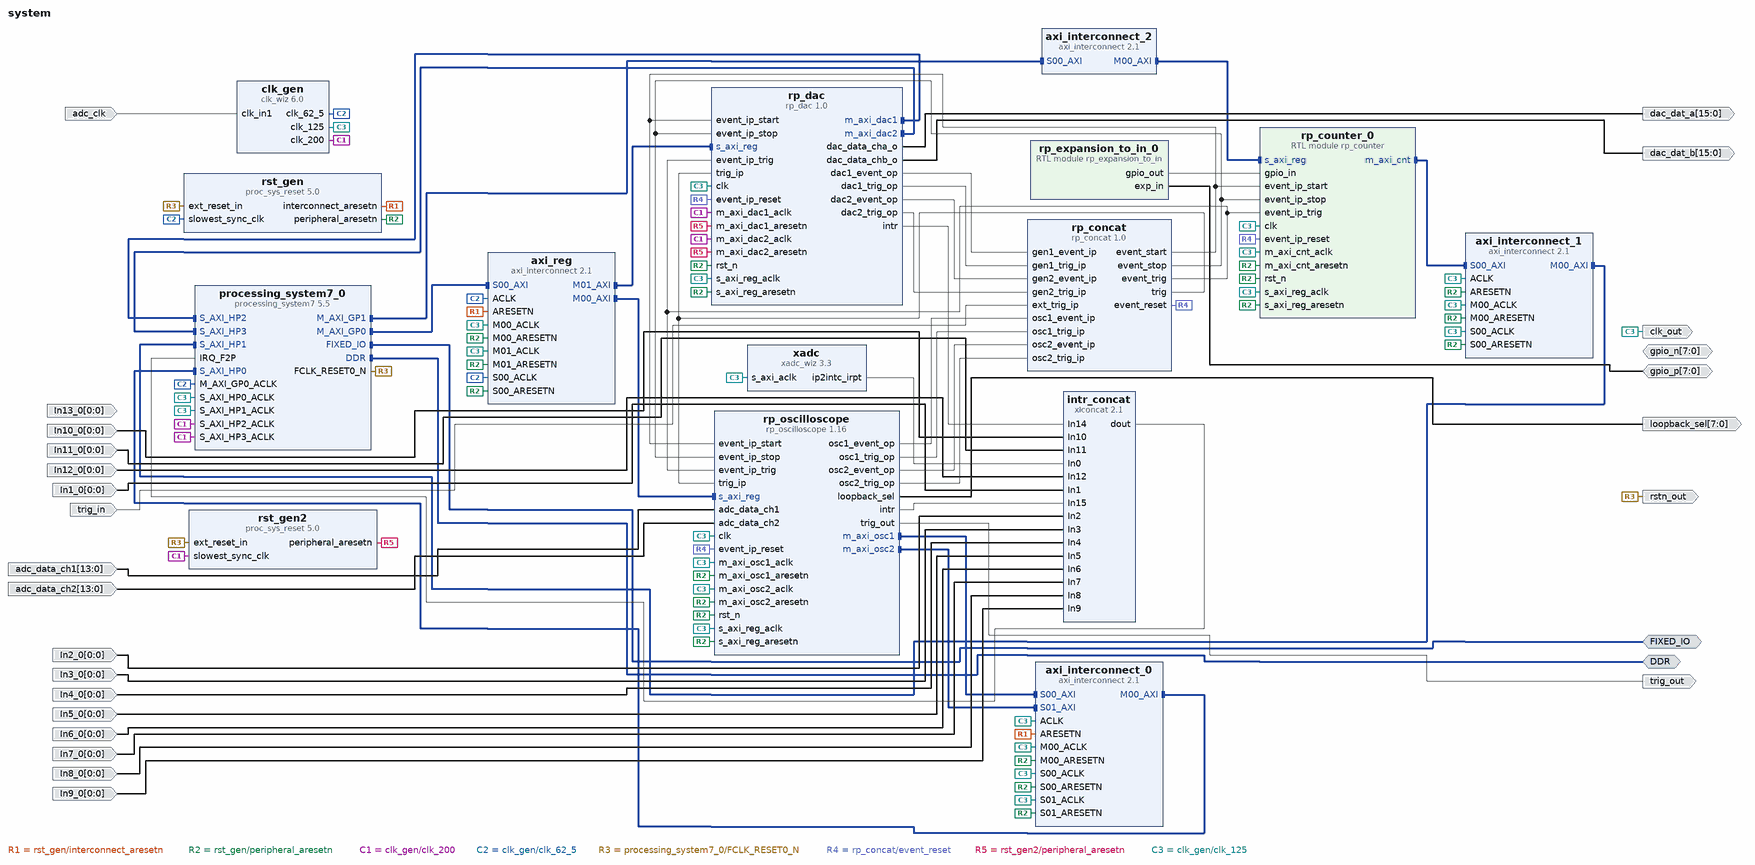
[diagram p0: block diagram of the top level]
# Vivado block design system, xc7z010clg400-1, Vivado 2020.1
create_bd_design system

create_bd_intf_port -mode Master -vlnv xilinx.com:interface:ddrx_rtl:1.0 DDR
create_bd_intf_port -mode Master -vlnv xilinx.com:display_processing_system7:fixedio_rtl:1.0 FIXED_IO
create_bd_port -dir I -from 0 -to 0 In10_0
create_bd_port -dir I -from 0 -to 0 In11_0
create_bd_port -dir I -from 0 -to 0 In12_0
create_bd_port -dir I -from 0 -to 0 In13_0
create_bd_port -dir I -from 0 -to 0 In1_0
create_bd_port -dir I -from 0 -to 0 In2_0
create_bd_port -dir I -from 0 -to 0 In3_0
create_bd_port -dir I -from 0 -to 0 In4_0
create_bd_port -dir I -from 0 -to 0 In5_0
create_bd_port -dir I -from 0 -to 0 In6_0
create_bd_port -dir I -from 0 -to 0 In7_0
create_bd_port -dir I -from 0 -to 0 In8_0
create_bd_port -dir I -from 0 -to 0 In9_0
create_bd_port -dir I -type clk adc_clk
set_property -dict {CONFIG.FREQ_HZ 125000000} [get_bd_ports adc_clk]
create_bd_port -dir I -from 13 -to 0 adc_data_ch1
create_bd_port -dir I -from 13 -to 0 adc_data_ch2
create_bd_port -dir O -type clk clk_out
set_property -dict {CONFIG.FREQ_HZ 125000000} [get_bd_ports clk_out]
create_bd_port -dir O -from 15 -to 0 dac_dat_a
create_bd_port -dir O -from 15 -to 0 dac_dat_b
create_bd_port -dir IO -from 7 -to 0 gpio_n
create_bd_port -dir IO -from 7 -to 0 gpio_p
create_bd_port -dir O -from 7 -to 0 loopback_sel
create_bd_port -dir O -type rst rstn_out
create_bd_port -dir I trig_in
create_bd_port -dir O trig_out

create_bd_cell -type ip -vlnv xilinx.com:ip:axi_interconnect:2.1 axi_interconnect_0
set_property -dict {CONFIG.NUM_MI 1 CONFIG.NUM_SI 2} [get_bd_cells axi_interconnect_0]
create_bd_cell -type ip -vlnv xilinx.com:ip:axi_interconnect:2.1 axi_reg
set_property -dict {CONFIG.ENABLE_ADVANCED_OPTIONS 1 CONFIG.NUM_MI 2 CONFIG.S00_HAS_REGSLICE 0} [get_bd_cells axi_reg]
create_bd_cell -type ip -vlnv xilinx.com:ip:clk_wiz:6.0 clk_gen
set_property -dict [list \
  CONFIG.CLKIN1_JITTER_PS 80.0 \
  CONFIG.CLKOUT1_JITTER 119.348 \
  CONFIG.CLKOUT1_PHASE_ERROR 96.948 \
  CONFIG.CLKOUT1_REQUESTED_OUT_FREQ 125 \
  CONFIG.CLKOUT2_JITTER 104.759 \
  CONFIG.CLKOUT2_PHASE_ERROR 96.948 \
  CONFIG.CLKOUT2_REQUESTED_OUT_FREQ 250 \
  CONFIG.CLKOUT2_USED true \
  CONFIG.CLKOUT3_JITTER 99.263 \
  CONFIG.CLKOUT3_PHASE_ERROR 96.948 \
  CONFIG.CLKOUT3_REQUESTED_OUT_FREQ 333.33333 \
  CONFIG.CLKOUT3_USED true \
  CONFIG.CLKOUT4_JITTER 137.150 \
  CONFIG.CLKOUT4_PHASE_ERROR 96.948 \
  CONFIG.CLKOUT4_REQUESTED_OUT_FREQ 62.5 \
  CONFIG.CLKOUT4_USED true \
  CONFIG.CLK_OUT1_PORT clk_125 \
  CONFIG.CLK_OUT2_PORT clk_200 \
  CONFIG.CLK_OUT3_PORT clk_333 \
  CONFIG.CLK_OUT4_PORT clk_62_5 \
  CONFIG.ENABLE_CLOCK_MONITOR false \
  CONFIG.MMCM_CLKFBOUT_MULT_F 8.000 \
  CONFIG.MMCM_CLKIN1_PERIOD 8.000 \
  CONFIG.MMCM_CLKOUT0_DIVIDE_F 8.000 \
  CONFIG.MMCM_CLKOUT1_DIVIDE 4 \
  CONFIG.MMCM_CLKOUT2_DIVIDE 3 \
  CONFIG.MMCM_CLKOUT3_DIVIDE 16 \
  CONFIG.NUM_OUT_CLKS 4 \
  CONFIG.PRIMITIVE MMCM \
  CONFIG.PRIM_IN_FREQ 125 \
  CONFIG.USE_LOCKED false \
  CONFIG.USE_RESET false \
] [get_bd_cells clk_gen]
create_bd_cell -type ip -vlnv xilinx.com:ip:xlconcat:2.1 intr_concat
set_property -dict {CONFIG.NUM_PORTS 16} [get_bd_cells intr_concat]
create_bd_cell -type ip -vlnv xilinx.com:ip:processing_system7:5.5 processing_system7_0
set_property -dict [list \
  CONFIG.PCW_APU_PERIPHERAL_FREQMHZ 666.666666 \
  CONFIG.PCW_ENET0_ENET0_IO {MIO 16 .. 27} \
  CONFIG.PCW_ENET0_GRP_MDIO_ENABLE 1 \
  CONFIG.PCW_ENET0_GRP_MDIO_IO {MIO 52 .. 53} \
  CONFIG.PCW_ENET0_PERIPHERAL_ENABLE 1 \
  CONFIG.PCW_ENET0_RESET_ENABLE 0 \
  CONFIG.PCW_ENET_RESET_ENABLE 1 \
  CONFIG.PCW_ENET_RESET_SELECT {Share reset pin} \
  CONFIG.PCW_EN_CLK1_PORT 1 \
  CONFIG.PCW_FCLK_CLK1_BUF TRUE \
  CONFIG.PCW_FPGA0_PERIPHERAL_FREQMHZ 50 \
  CONFIG.PCW_FPGA1_PERIPHERAL_FREQMHZ 25 \
  CONFIG.PCW_FPGA_FCLK1_ENABLE 1 \
  CONFIG.PCW_GPIO_EMIO_GPIO_ENABLE 1 \
  CONFIG.PCW_GPIO_EMIO_GPIO_IO 24 \
  CONFIG.PCW_GPIO_EMIO_GPIO_WIDTH 24 \
  CONFIG.PCW_GPIO_MIO_GPIO_ENABLE 1 \
  CONFIG.PCW_GPIO_MIO_GPIO_IO MIO \
  CONFIG.PCW_I2C0_GRP_INT_ENABLE 0 \
  CONFIG.PCW_I2C0_I2C0_IO {MIO 50 .. 51} \
  CONFIG.PCW_I2C0_PERIPHERAL_ENABLE 1 \
  CONFIG.PCW_I2C_PERIPHERAL_FREQMHZ 111.111115 \
  CONFIG.PCW_I2C_RESET_ENABLE 1 \
  CONFIG.PCW_I2C_RESET_SELECT {Share reset pin} \
  CONFIG.PCW_IRQ_F2P_INTR 1 \
  CONFIG.PCW_PERIPHERAL_BOARD_PRESET part0 \
  CONFIG.PCW_PRESET_BANK1_VOLTAGE {LVCMOS 2.5V} \
  CONFIG.PCW_QSPI_GRP_SINGLE_SS_ENABLE 1 \
  CONFIG.PCW_QSPI_GRP_SINGLE_SS_IO {MIO 1 .. 6} \
  CONFIG.PCW_QSPI_PERIPHERAL_ENABLE 1 \
  CONFIG.PCW_QSPI_QSPI_IO {MIO 1 .. 6} \
  CONFIG.PCW_SD0_GRP_CD_ENABLE 1 \
  CONFIG.PCW_SD0_GRP_CD_IO {MIO 46} \
  CONFIG.PCW_SD0_GRP_WP_ENABLE 1 \
  CONFIG.PCW_SD0_GRP_WP_IO {MIO 47} \
  CONFIG.PCW_SD0_PERIPHERAL_ENABLE 1 \
  CONFIG.PCW_SD0_SD0_IO {MIO 40 .. 45} \
  CONFIG.PCW_SDIO_PERIPHERAL_FREQMHZ 100 \
  CONFIG.PCW_SINGLE_QSPI_DATA_MODE x4 \
  CONFIG.PCW_SPI1_PERIPHERAL_ENABLE 1 \
  CONFIG.PCW_SPI1_SPI1_IO {MIO 10 .. 15} \
  CONFIG.PCW_S_AXI_HP2_ID_WIDTH 4 \
  CONFIG.PCW_S_AXI_HP3_ID_WIDTH 4 \
  CONFIG.PCW_TTC0_PERIPHERAL_ENABLE 1 \
  CONFIG.PCW_TTC0_TTC0_IO EMIO \
  CONFIG.PCW_UART0_PERIPHERAL_ENABLE 1 \
  CONFIG.PCW_UART0_UART0_IO {MIO 14 .. 15} \
  CONFIG.PCW_UART1_PERIPHERAL_ENABLE 1 \
  CONFIG.PCW_UART1_UART1_IO {MIO 8 .. 9} \
  CONFIG.PCW_UART_PERIPHERAL_FREQMHZ 100 \
  CONFIG.PCW_UIPARAM_DDR_BUS_WIDTH {16 Bit} \
  CONFIG.PCW_UIPARAM_DDR_FREQ_MHZ 533.333333 \
  CONFIG.PCW_UIPARAM_DDR_PARTNO {MT41J256M16 RE-125} \
  CONFIG.PCW_USB0_PERIPHERAL_ENABLE 1 \
  CONFIG.PCW_USB0_RESET_ENABLE 1 \
  CONFIG.PCW_USB0_RESET_IO {MIO 48} \
  CONFIG.PCW_USB0_USB0_IO {MIO 28 .. 39} \
  CONFIG.PCW_USB_RESET_ENABLE 1 \
  CONFIG.PCW_USB_RESET_SELECT {Share reset pin} \
  CONFIG.PCW_USE_FABRIC_INTERRUPT 1 \
  CONFIG.PCW_USE_M_AXI_GP1 1 \
  CONFIG.PCW_USE_S_AXI_HP0 1 \
  CONFIG.PCW_USE_S_AXI_HP1 1 \
  CONFIG.PCW_USE_S_AXI_HP2 1 \
  CONFIG.PCW_USE_S_AXI_HP3 1 \
] [get_bd_cells processing_system7_0]
# 543 more settings of processing_system7_0 are not shown: defaults, MIO pin electricals, DDR timing, and values the tool derives
create_bd_cell -type ip -vlnv redpitaya.com:user:rp_concat:1.0 rp_concat
set_property -dict {CONFIG.EVENT_SRC_NUM 5 CONFIG.TRIG_SRC_NUM 6} [get_bd_cells rp_concat]
create_bd_cell -type ip -vlnv redpitaya.com:user:rp_dac:1.0 rp_dac
set_property -dict [list \
  CONFIG.DAC_DATA_BITS 16 \
  CONFIG.EVENT_SRC_NUM 5 \
  CONFIG.ID_WIDTH 4 \
  CONFIG.M_AXI_DAC_ADDR_BITS 32 \
  CONFIG.M_AXI_DAC_DATA_BITS 64 \
  CONFIG.M_AXI_DAC_DATA_BITS_O 64 \
  CONFIG.TRIG_SRC_NUM 6 \
] [get_bd_cells rp_dac]
create_bd_cell -type ip -vlnv redpitaya.com:user:rp_oscilloscope:1.16 rp_oscilloscope
set_property -dict {CONFIG.ADC_DATA_BITS 14 CONFIG.EVENT_SRC_NUM 5 CONFIG.TRIG_SRC_NUM 6} [get_bd_cells rp_oscilloscope]
create_bd_cell -type ip -vlnv xilinx.com:ip:proc_sys_reset:5.0 rst_gen
create_bd_cell -type ip -vlnv xilinx.com:ip:proc_sys_reset:5.0 rst_gen2
create_bd_cell -type ip -vlnv xilinx.com:ip:xadc_wiz:3.3 xadc
set_property -dict [list \
  CONFIG.CHANNEL_ENABLE_VAUXP0_VAUXN0 true \
  CONFIG.CHANNEL_ENABLE_VAUXP1_VAUXN1 true \
  CONFIG.CHANNEL_ENABLE_VAUXP8_VAUXN8 true \
  CONFIG.CHANNEL_ENABLE_VAUXP9_VAUXN9 true \
  CONFIG.CHANNEL_ENABLE_VP_VN true \
  CONFIG.ENABLE_RESET false \
  CONFIG.EXTERNAL_MUX_CHANNEL VP_VN \
  CONFIG.INTERFACE_SELECTION Enable_AXI \
  CONFIG.SEQUENCER_MODE Off \
  CONFIG.SINGLE_CHANNEL_SELECTION TEMPERATURE \
  CONFIG.XADC_STARUP_SELECTION independent_adc \
] [get_bd_cells xadc]
create_bd_cell -type ip -vlnv xilinx.com:ip:axi_interconnect:2.1 axi_interconnect_1
set_property -dict {CONFIG.NUM_MI 1} [get_bd_cells axi_interconnect_1]
create_bd_cell -type module -reference rp_expansion_to_in rp_expansion_to_in_0
set_property -dict {CONFIG.N_CON 0} [get_bd_cells rp_expansion_to_in_0]
create_bd_cell -type module -reference rp_counter rp_counter_0
create_bd_cell -type ip -vlnv xilinx.com:ip:axi_interconnect:2.1 axi_interconnect_2
set_property -dict {CONFIG.NUM_MI 1} [get_bd_cells axi_interconnect_2]

# ---- connections ----

connect_bd_intf_net [get_bd_intf_ports FIXED_IO] [get_bd_intf_pins processing_system7_0/FIXED_IO]
connect_bd_intf_net [get_bd_intf_pins axi_reg/S00_AXI] [get_bd_intf_pins processing_system7_0/M_AXI_GP0]
connect_bd_intf_net [get_bd_intf_pins processing_system7_0/S_AXI_HP2] [get_bd_intf_pins rp_dac/m_axi_dac1]
connect_bd_intf_net [get_bd_intf_pins processing_system7_0/S_AXI_HP3] [get_bd_intf_pins rp_dac/m_axi_dac2]
connect_bd_intf_net [get_bd_intf_pins axi_interconnect_0/S00_AXI] [get_bd_intf_pins rp_oscilloscope/m_axi_osc1]
connect_bd_intf_net [get_bd_intf_pins axi_interconnect_0/S01_AXI] [get_bd_intf_pins rp_oscilloscope/m_axi_osc2]
connect_bd_intf_net [get_bd_intf_ports DDR] [get_bd_intf_pins processing_system7_0/DDR]
connect_bd_intf_net [get_bd_intf_pins axi_reg/M01_AXI] [get_bd_intf_pins rp_dac/s_axi_reg]
connect_bd_intf_net [get_bd_intf_pins axi_reg/M00_AXI] [get_bd_intf_pins rp_oscilloscope/s_axi_reg]
connect_bd_intf_net [get_bd_intf_pins axi_interconnect_0/M00_AXI] [get_bd_intf_pins processing_system7_0/S_AXI_HP0]
connect_bd_intf_net [get_bd_intf_pins axi_interconnect_1/M00_AXI] [get_bd_intf_pins processing_system7_0/S_AXI_HP1]
connect_bd_intf_net [get_bd_intf_pins rp_counter_0/m_axi_cnt] [get_bd_intf_pins axi_interconnect_1/S00_AXI]
connect_bd_intf_net [get_bd_intf_pins rp_counter_0/s_axi_reg] [get_bd_intf_pins axi_interconnect_2/M00_AXI]
connect_bd_intf_net [get_bd_intf_pins axi_interconnect_2/S00_AXI] [get_bd_intf_pins processing_system7_0/M_AXI_GP1]
connect_bd_net -net ARESETN_1 [get_bd_pins rst_gen/interconnect_aresetn] [get_bd_pins axi_interconnect_0/ARESETN] [get_bd_pins axi_reg/ARESETN]
connect_bd_net -net In10_0_1 [get_bd_ports In10_0] [get_bd_pins intr_concat/In10]
connect_bd_net -net In11_0_1 [get_bd_ports In11_0] [get_bd_pins intr_concat/In11]
connect_bd_net -net In12_0_1 [get_bd_ports In12_0] [get_bd_pins intr_concat/In12]
connect_bd_net -net In1_0_1 [get_bd_ports In1_0] [get_bd_pins intr_concat/In1]
connect_bd_net -net In2_0_1 [get_bd_ports In2_0] [get_bd_pins intr_concat/In2]
connect_bd_net -net In3_0_1 [get_bd_ports In3_0] [get_bd_pins intr_concat/In3]
connect_bd_net -net In4_0_1 [get_bd_ports In4_0] [get_bd_pins intr_concat/In4]
connect_bd_net -net In5_0_1 [get_bd_ports In5_0] [get_bd_pins intr_concat/In5]
connect_bd_net -net In6_0_1 [get_bd_ports In6_0] [get_bd_pins intr_concat/In6]
connect_bd_net -net In7_0_1 [get_bd_ports In7_0] [get_bd_pins intr_concat/In7]
connect_bd_net -net In8_0_1 [get_bd_ports In8_0] [get_bd_pins intr_concat/In8]
connect_bd_net -net In9_0_1 [get_bd_ports In9_0] [get_bd_pins intr_concat/In9]
connect_bd_net -net M00_ARESETN_1 [get_bd_pins rst_gen/peripheral_aresetn] \
  [get_bd_pins axi_interconnect_0/M00_ARESETN] [get_bd_pins axi_interconnect_0/S00_ARESETN] \
  [get_bd_pins axi_interconnect_0/S01_ARESETN] [get_bd_pins axi_reg/M00_ARESETN] [get_bd_pins axi_reg/M01_ARESETN] \
  [get_bd_pins axi_reg/S00_ARESETN] [get_bd_pins rp_dac/rst_n] [get_bd_pins rp_dac/s_axi_reg_aresetn] \
  [get_bd_pins rp_oscilloscope/m_axi_osc1_aresetn] [get_bd_pins rp_oscilloscope/m_axi_osc2_aresetn] \
  [get_bd_pins rp_oscilloscope/rst_n] [get_bd_pins rp_oscilloscope/s_axi_reg_aresetn] \
  [get_bd_pins axi_interconnect_1/M00_ARESETN] [get_bd_pins axi_interconnect_1/S00_ARESETN] \
  [get_bd_pins axi_interconnect_1/ARESETN] [get_bd_pins rp_counter_0/rst_n] [get_bd_pins rp_counter_0/s_axi_reg_aresetn] \
  [get_bd_pins rp_counter_0/m_axi_cnt_aresetn]
connect_bd_net [get_bd_ports adc_clk] [get_bd_pins clk_gen/clk_in1]
connect_bd_net -net adc_data_ch1_0_1 [get_bd_ports adc_data_ch1] [get_bd_pins rp_oscilloscope/adc_data_ch1]
connect_bd_net -net adc_data_ch2_0_1 [get_bd_ports adc_data_ch2] [get_bd_pins rp_oscilloscope/adc_data_ch2]
connect_bd_net [get_bd_pins clk_gen/clk_200] \
  [get_bd_pins processing_system7_0/S_AXI_HP2_ACLK] [get_bd_pins processing_system7_0/S_AXI_HP3_ACLK] \
  [get_bd_pins rp_dac/m_axi_dac1_aclk] [get_bd_pins rp_dac/m_axi_dac2_aclk] [get_bd_pins rst_gen2/slowest_sync_clk]
connect_bd_net [get_bd_pins clk_gen/clk_62_5] \
  [get_bd_pins axi_reg/ACLK] [get_bd_pins axi_reg/S00_ACLK] [get_bd_pins processing_system7_0/M_AXI_GP0_ACLK] \
  [get_bd_pins rst_gen/slowest_sync_clk]
connect_bd_net -net dac_data_ch1_0_1 [get_bd_pins rp_dac/dac_data_cha_o] [get_bd_ports dac_dat_a]
connect_bd_net -net dac_data_ch2_0_1 [get_bd_pins rp_dac/dac_data_chb_o] [get_bd_ports dac_dat_b]
connect_bd_net -net loopback_sel_scope [get_bd_pins rp_oscilloscope/loopback_sel] [get_bd_ports loopback_sel]
connect_bd_net [get_bd_pins processing_system7_0/FCLK_RESET0_N] \
  [get_bd_ports rstn_out] [get_bd_pins rst_gen/ext_reset_in] [get_bd_pins rst_gen2/ext_reset_in]
connect_bd_net -net rp_concat_0_event_reset [get_bd_pins rp_concat/event_reset] \
  [get_bd_pins rp_dac/event_ip_reset] [get_bd_pins rp_oscilloscope/event_ip_reset] [get_bd_pins rp_counter_0/event_ip_reset]
connect_bd_net -net rp_concat_0_event_start [get_bd_pins rp_concat/event_start] \
  [get_bd_pins rp_dac/event_ip_start] [get_bd_pins rp_oscilloscope/event_ip_start] [get_bd_pins rp_counter_0/event_ip_start]
connect_bd_net -net rp_concat_0_event_stop [get_bd_pins rp_concat/event_stop] \
  [get_bd_pins rp_dac/event_ip_stop] [get_bd_pins rp_oscilloscope/event_ip_stop] [get_bd_pins rp_counter_0/event_ip_stop]
connect_bd_net [get_bd_pins rp_concat/event_trig] \
  [get_bd_pins rp_dac/event_ip_trig] [get_bd_pins rp_oscilloscope/event_ip_trig] [get_bd_pins rp_counter_0/event_ip_trig]
connect_bd_net -net rp_concat_ext_trig_ip [get_bd_ports trig_in] [get_bd_pins rp_concat/ext_trig_ip]
connect_bd_net [get_bd_pins rp_concat/trig] [get_bd_pins rp_dac/trig_ip] [get_bd_pins rp_oscilloscope/trig_ip]
connect_bd_net [get_bd_pins rp_dac/dac1_event_op] [get_bd_pins rp_concat/gen1_event_ip]
connect_bd_net [get_bd_pins rp_dac/dac1_trig_op] [get_bd_pins rp_concat/gen1_trig_ip]
connect_bd_net [get_bd_pins rp_dac/dac2_event_op] [get_bd_pins rp_concat/gen2_event_ip]
connect_bd_net [get_bd_pins rp_dac/dac2_trig_op] [get_bd_pins rp_concat/gen2_trig_ip]
connect_bd_net [get_bd_pins rp_dac/intr] [get_bd_pins intr_concat/In14]
connect_bd_net -net rp_oscilloscope_0_intr [get_bd_pins rp_oscilloscope/intr] [get_bd_pins intr_concat/In15]
connect_bd_net -net rp_oscilloscope_0_osc1_event_op [get_bd_pins rp_oscilloscope/osc1_event_op] [get_bd_pins rp_concat/osc1_event_ip]
connect_bd_net -net rp_oscilloscope_0_osc1_trig_op [get_bd_pins rp_oscilloscope/osc1_trig_op] [get_bd_pins rp_concat/osc1_trig_ip]
connect_bd_net -net rp_oscilloscope_0_osc2_event_op [get_bd_pins rp_oscilloscope/osc2_event_op] [get_bd_pins rp_concat/osc2_event_ip]
connect_bd_net -net rp_oscilloscope_0_osc2_trig_op [get_bd_pins rp_oscilloscope/osc2_trig_op] [get_bd_pins rp_concat/osc2_trig_ip]
connect_bd_net [get_bd_pins rp_oscilloscope/trig_out] [get_bd_ports trig_out]
connect_bd_net [get_bd_pins rst_gen2/peripheral_aresetn] [get_bd_pins rp_dac/m_axi_dac1_aresetn] [get_bd_pins rp_dac/m_axi_dac2_aresetn]
connect_bd_net [get_bd_pins xadc/ip2intc_irpt] [get_bd_pins intr_concat/In0]
connect_bd_net -net xlconcat_0_dout [get_bd_pins intr_concat/dout] [get_bd_pins processing_system7_0/IRQ_F2P]
connect_bd_net -net clk_wiz_0_adc_clk [get_bd_pins clk_gen/clk_125] \
  [get_bd_ports clk_out] [get_bd_pins axi_interconnect_0/ACLK] [get_bd_pins axi_interconnect_0/M00_ACLK] \
  [get_bd_pins axi_interconnect_0/S00_ACLK] [get_bd_pins axi_interconnect_0/S01_ACLK] [get_bd_pins axi_reg/M00_ACLK] \
  [get_bd_pins axi_reg/M01_ACLK] [get_bd_pins processing_system7_0/S_AXI_HP0_ACLK] \
  [get_bd_pins processing_system7_0/S_AXI_HP1_ACLK] [get_bd_pins rp_dac/clk] [get_bd_pins rp_dac/s_axi_reg_aclk] \
  [get_bd_pins rp_oscilloscope/clk] [get_bd_pins rp_oscilloscope/m_axi_osc1_aclk] \
  [get_bd_pins rp_oscilloscope/m_axi_osc2_aclk] [get_bd_pins rp_oscilloscope/s_axi_reg_aclk] [get_bd_pins xadc/s_axi_aclk] \
  [get_bd_pins axi_interconnect_1/M00_ACLK] [get_bd_pins axi_interconnect_1/S00_ACLK] [get_bd_pins axi_interconnect_1/ACLK] \
  [get_bd_pins rp_counter_0/clk] [get_bd_pins rp_counter_0/s_axi_reg_aclk] [get_bd_pins rp_counter_0/m_axi_cnt_aclk]
connect_bd_net [get_bd_ports gpio_p] [get_bd_pins rp_expansion_to_in_0/exp_in]
connect_bd_net [get_bd_pins rp_expansion_to_in_0/gpio_out] [get_bd_pins rp_counter_0/gpio_in]

# ---- address map ----
assign_bd_address -offset 0x40000000 -range 1M -target_address_space [get_bd_addr_spaces processing_system7_0/Data] [get_bd_addr_segs rp_oscilloscope/s_axi_reg/reg0]
assign_bd_address -offset 0x40100000 -range 1M -target_address_space [get_bd_addr_spaces processing_system7_0/Data] [get_bd_addr_segs rp_dac/s_axi_reg/reg0]
assign_bd_address -offset 0x80000000 -range 1M -target_address_space [get_bd_addr_spaces processing_system7_0/Data] [get_bd_addr_segs rp_counter_0/s_axi_reg/reg0]
assign_bd_address -offset 0x00000000 -range 512M -target_address_space [get_bd_addr_spaces rp_counter_0/m_axi_cnt] [get_bd_addr_segs processing_system7_0/S_AXI_HP1/HP1_DDR_LOWOCM]
assign_bd_address -offset 0x00000000 -range 512M -target_address_space [get_bd_addr_spaces rp_dac/m_axi_dac1] [get_bd_addr_segs processing_system7_0/S_AXI_HP2/HP2_DDR_LOWOCM]
assign_bd_address -offset 0x00000000 -range 512M -target_address_space [get_bd_addr_spaces rp_dac/m_axi_dac2] [get_bd_addr_segs processing_system7_0/S_AXI_HP3/HP3_DDR_LOWOCM]
assign_bd_address -offset 0x00000000 -range 512M -target_address_space [get_bd_addr_spaces rp_oscilloscope/m_axi_osc1] [get_bd_addr_segs processing_system7_0/S_AXI_HP0/HP0_DDR_LOWOCM]
assign_bd_address -offset 0x00000000 -range 512M -target_address_space [get_bd_addr_spaces rp_oscilloscope/m_axi_osc2] [get_bd_addr_segs processing_system7_0/S_AXI_HP0/HP0_DDR_LOWOCM]

validate_bd_design
save_bd_design
